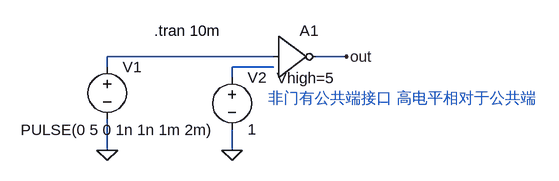
[diagram p0: schematic Draft1.asc]
Draft1.asc, the LTspice schematic file:
Version 4
SHEET 1 880 680
WIRE 432 272 176 272
WIRE 544 272 496 272
WIRE 176 288 176 272
WIRE 432 288 368 288
WIRE 368 304 368 288
WIRE 176 416 176 368
WIRE 368 416 368 384
FLAG 368 416 0
FLAG 176 416 0
FLAG 544 272 out
SYMBOL Digital/inv 432 208 R0
WINDOW 3 5 97 Left 2
SYMATTR InstName A1
SYMATTR Value Vhigh=5
SYMBOL Voltage 176 272 R0
WINDOW 3 -133 113 Left 2
SYMATTR InstName V1
SYMATTR Value PULSE(0 5 0 1n 1n 1m 2m)
SYMBOL Voltage 368 288 R0
SYMATTR InstName V2
SYMATTR Value 1
TEXT 424 336 Left 2 ;非门有公共端接口 高电平相对于公共端
TEXT 248 232 Left 2 !.tran 10m

The netlist it stands for:
* Draft1.asc
A1 N001 N002 N002 N002 N002 out N002 N002 BUF Vhigh=5
V1 N001 0 PULSE(0 5 0 1n 1n 1m 2m)
V2 N002 0 1
* 非门有公共端接口 高电平相对于公共端
.tran 10m
.backanno
.end